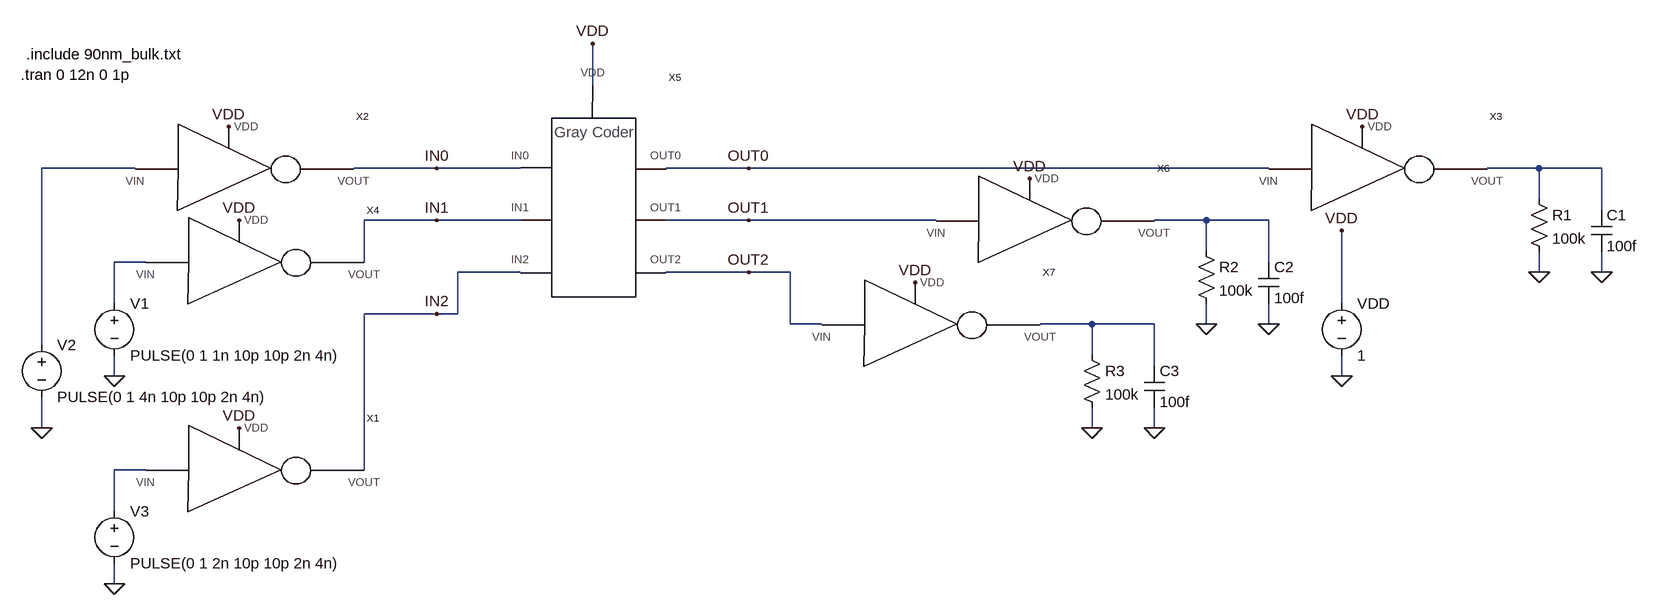
[diagram p0: schematic task_2.asc]
task_2.asc, the LTspice schematic file:
Version 4
SHEET 1 1740 1524
WIRE 0 464 0 400
WIRE -704 592 -848 592
WIRE -240 592 -368 592
WIRE -112 592 -240 592
WIRE 240 592 112 592
WIRE 1040 592 240 592
WIRE 1456 592 1376 592
WIRE 1552 592 1456 592
WIRE 1456 640 1456 592
WIRE 1552 656 1552 592
WIRE -240 672 -352 672
WIRE -112 672 -240 672
WIRE 240 672 112 672
WIRE 528 672 240 672
WIRE 944 672 864 672
WIRE 1040 672 944 672
WIRE 944 720 944 672
WIRE -688 736 -736 736
WIRE -352 736 -352 672
WIRE 1040 736 1040 672
WIRE -112 752 -208 752
WIRE 240 752 112 752
WIRE 304 752 240 752
WIRE 1456 752 1456 720
WIRE 1552 752 1552 720
WIRE -736 800 -736 736
WIRE 1152 800 1152 688
WIRE -240 816 -352 816
WIRE -208 816 -208 752
WIRE -208 816 -240 816
WIRE 304 832 304 752
WIRE 352 832 304 832
WIRE 768 832 688 832
WIRE 864 832 768 832
WIRE 944 832 944 800
WIRE 1040 832 1040 800
WIRE -848 864 -848 592
WIRE 768 880 768 832
WIRE 864 896 864 832
WIRE -736 912 -736 880
WIRE 1152 912 1152 880
WIRE -848 992 -848 944
WIRE 768 992 768 960
WIRE 864 992 864 960
WIRE -688 1056 -736 1056
WIRE -352 1056 -352 816
WIRE -736 1120 -736 1056
WIRE -736 1232 -736 1200
FLAG 0 400 VDD
FLAG 1152 688 VDD
FLAG 1152 912 0
FLAG -848 992 0
FLAG -736 912 0
FLAG 1456 752 0
FLAG 1552 752 0
FLAG -560 528 VDD
FLAG -544 672 VDD
FLAG 1184 528 VDD
FLAG -736 1232 0
FLAG -544 992 VDD
FLAG 944 832 0
FLAG 1040 832 0
FLAG 672 608 VDD
FLAG 768 992 0
FLAG 864 992 0
FLAG 496 768 VDD
FLAG -240 592 IN0
FLAG -240 672 IN1
FLAG -240 816 IN2
FLAG 240 592 OUT0
FLAG 240 672 OUT1
FLAG 240 752 OUT2
SYMBOL voltage 1152 784 R0
WINDOW 123 0 0 Left 2
WINDOW 39 0 0 Left 2
SYMATTR InstName VDD
SYMATTR Value 1
SYMBOL voltage -848 848 R0
WINDOW 123 0 0 Left 2
WINDOW 39 0 0 Left 2
SYMATTR InstName V2
SYMATTR Value PULSE(0 1 4n 10p 10p 2n 4n)
SYMBOL voltage -736 784 R0
WINDOW 123 0 0 Left 2
WINDOW 39 0 0 Left 2
SYMATTR InstName V1
SYMATTR Value PULSE(0 1 1n 10p 10p 2n 4n)
SYMBOL res 1440 624 R0
SYMATTR InstName R1
SYMATTR Value 100k
SYMBOL cap 1536 656 R0
SYMATTR InstName C1
SYMATTR Value 100f
SYMBOL inverter -576 592 R0
SYMATTR InstName X2
SYMBOL inverter 1168 592 R0
SYMATTR InstName X3
SYMBOL inverter -560 736 R0
SYMATTR InstName X4
SYMBOL gray 0 672 R0
SYMATTR InstName X5
SYMBOL inverter -560 1056 R0
SYMATTR InstName X1
SYMBOL voltage -736 1104 R0
WINDOW 123 0 0 Left 2
WINDOW 39 0 0 Left 2
SYMATTR InstName V3
SYMATTR Value PULSE(0 1 2n 10p 10p 2n 4n)
SYMBOL res 928 704 R0
SYMATTR InstName R2
SYMATTR Value 100k
SYMBOL cap 1024 736 R0
SYMATTR InstName C2
SYMATTR Value 100f
SYMBOL inverter 656 672 R0
SYMATTR InstName X6
SYMBOL res 752 864 R0
SYMATTR InstName R3
SYMATTR Value 100k
SYMBOL cap 848 896 R0
SYMATTR InstName C3
SYMATTR Value 100f
SYMBOL inverter 480 832 R0
SYMATTR InstName X7
TEXT -880 448 Left 2 !.tran 0 12n 0 1p
TEXT -872 416 Left 2 !.include 90nm_bulk.txt

The netlist it stands for:
* task_2.asc
VDD VDD 0 1
V2 N001 0 PULSE(0 1 4n 10p 10p 2n 4n)
V1 N004 0 PULSE(0 1 1n 10p 10p 2n 4n)
R1 N002 0 100k
C1 N002 0 100f
XX2 N001 IN0 VDD inverter  ; pins VIN VOUT VDD
XX3 OUT0 N002 VDD inverter  ; pins VIN VOUT VDD
XX4 N004 IN1 VDD inverter  ; pins VIN VOUT VDD
XX5 IN0 IN1 IN2 OUT0 OUT1 OUT2 VDD gray  ; pins IN0 IN1 IN2 OUT0 OUT1 OUT2 VDD
XX1 N006 IN2 VDD inverter  ; pins VIN VOUT VDD
V3 N006 0 PULSE(0 1 2n 10p 10p 2n 4n)
R2 N003 0 100k
C2 N003 0 100f
XX6 OUT1 N003 VDD inverter  ; pins VIN VOUT VDD
R3 N005 0 100k
C3 N005 0 100f
XX7 OUT2 N005 VDD inverter  ; pins VIN VOUT VDD
.tran 0 12n 0 1p
.include 90nm_bulk.txt
.backanno
.end

* Results of the author's LTspice run, read from the files saved beside the schematic
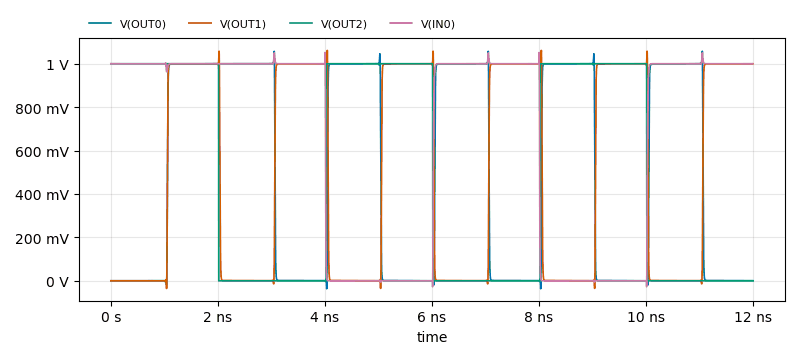
[diagram p1: Transient Analysis of task_2.asc, plotted from the saved traces]
* Transient Analysis, 1 run:
*   V(OUT0): min -36.8 mV, max 1.057 V, average 502.7 mV, rms 706.1 mV, last 500 µV
*   V(OUT1): min -35.36 mV, max 1.062 V, average 489.5 mV, rms 696.4 mV, last 999.9 mV
*   V(OUT2): min -1.641 mV, max 1 V, average 499.4 mV, rms 706.6 mV, last 0 V
*   V(IN0): min -27.34 mV, max 1.052 V, average 664.6 mV, rms 814.5 mV, last 999.9 mV